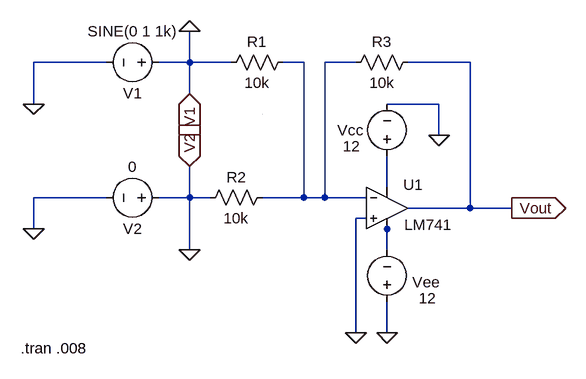
[diagram p0: schematic question.asc]
question.asc, the LTspice schematic file:
Version 4
SHEET 1 880 680
WIRE -240 -80 -352 -80
WIRE -112 -80 -112 -128
WIRE -112 -80 -160 -80
WIRE -48 -80 -112 -80
WIRE 64 -80 32 -80
WIRE 144 -80 96 -80
WIRE 320 -80 224 -80
WIRE -112 -32 -112 -80
WIRE -352 -16 -352 -80
WIRE 272 -16 192 -16
WIRE 272 32 272 -16
WIRE 192 112 192 64
WIRE -240 128 -352 128
WIRE -112 128 -112 80
WIRE -112 128 -160 128
WIRE -80 128 -112 128
WIRE 64 128 64 -80
WIRE 64 128 0 128
WIRE 96 128 96 -80
WIRE 96 128 64 128
WIRE 160 128 96 128
WIRE 320 144 320 -80
WIRE 320 144 224 144
WIRE 384 144 320 144
WIRE 160 160 144 160
WIRE -352 176 -352 128
WIRE 192 176 192 160
WIRE -112 208 -112 128
WIRE 192 208 192 176
WIRE 144 336 144 160
WIRE 192 336 192 288
WIRE 0 0 0 0
FLAG 144 336 0
FLAG 192 336 0
FLAG 384 144 Vout
IOPIN 384 144 Out
FLAG -112 -32 V1
IOPIN -112 -32 In
FLAG -112 80 V2
IOPIN -112 80 In
FLAG -352 -16 0
FLAG -352 176 0
FLAG 272 32 0
FLAG -112 208 0
FLAG -112 -128 0
SYMBOL LM741 192 80 R0
WINDOW 0 25 28 Left 2
WINDOW 3 27 90 Left 2
SYMATTR InstName U1
SYMBOL res 16 112 R90
WINDOW 0 0 56 VBottom 2
WINDOW 3 32 56 VTop 2
SYMATTR InstName R2
SYMATTR Value 10k
SYMBOL res 240 -96 R90
WINDOW 0 0 56 VBottom 2
WINDOW 3 32 56 VTop 2
SYMATTR InstName R3
SYMATTR Value 10k
SYMBOL voltage 192 80 R180
WINDOW 0 37 56 Left 2
WINDOW 3 41 31 Left 2
WINDOW 123 0 0 Left 0
WINDOW 39 0 0 Left 0
SYMATTR InstName Vcc
SYMATTR Value 12
SYMBOL voltage 192 304 R180
WINDOW 0 -82 46 Left 2
WINDOW 3 -76 21 Left 2
WINDOW 123 0 0 Left 0
WINDOW 39 0 0 Left 0
SYMATTR InstName Vee
SYMATTR Value 12
SYMBOL voltage -144 -80 R90
WINDOW 0 32 56 VTop 2
WINDOW 3 -32 56 VBottom 2
WINDOW 123 70 58 VTop 2
WINDOW 39 0 0 Left 0
SYMATTR InstName V1
SYMATTR Value SINE(0 1 1k)
SYMBOL voltage -144 128 R90
WINDOW 0 32 56 VTop 2
WINDOW 3 -32 56 VBottom 2
WINDOW 123 0 0 Left 0
WINDOW 39 0 0 Left 0
SYMATTR InstName V2
SYMATTR Value 0
SYMBOL res 48 -96 R90
WINDOW 0 0 56 VBottom 2
WINDOW 3 32 56 VTop 2
SYMATTR InstName R1
SYMATTR Value 10k
TEXT -372 360 Left 2 !.tran .008

The netlist it stands for:
* question.asc
XU1 0 N001 N002 N003 Vout LM741  ; pins In+ In- V+ V- OUT
R2 N001 0 10k
R3 Vout N001 10k
Vcc N002 0 12
Vee 0 N003 12
V1 0 0 SINE(0 1 1k)
V2 0 0 0
R1 N001 0 10k
.tran .008
.lib LM741.lib
.backanno
.end